# Altium schematic sheet P1.schdoc
size 297 x 209 mm; Symbol: Drawing-Symbol_A4; @Project Name: Traffic_Light_Controller_PCB; @Page Count: 1; @Update Date: 2026-06-30; @Create Date: 2026-06-30; @Schematic Name: Schematic1; @Page No: 1; @Page Name: P1; Company: EasyEDA.com; Version: V1.0; Page Size: A4; Device: Drawing-Symbol_A4; @Create Time: 14:19:58; @Update Time: 14:19:58; Border: 1; Width: 1170; Height: 825; Region Start: 1; X Region Count: 6; Y Region Count: 4; Blade Width: 10; Title Block Position: 3; @Board Name: Board1; SheetNumber: 1; SheetTotal: 1
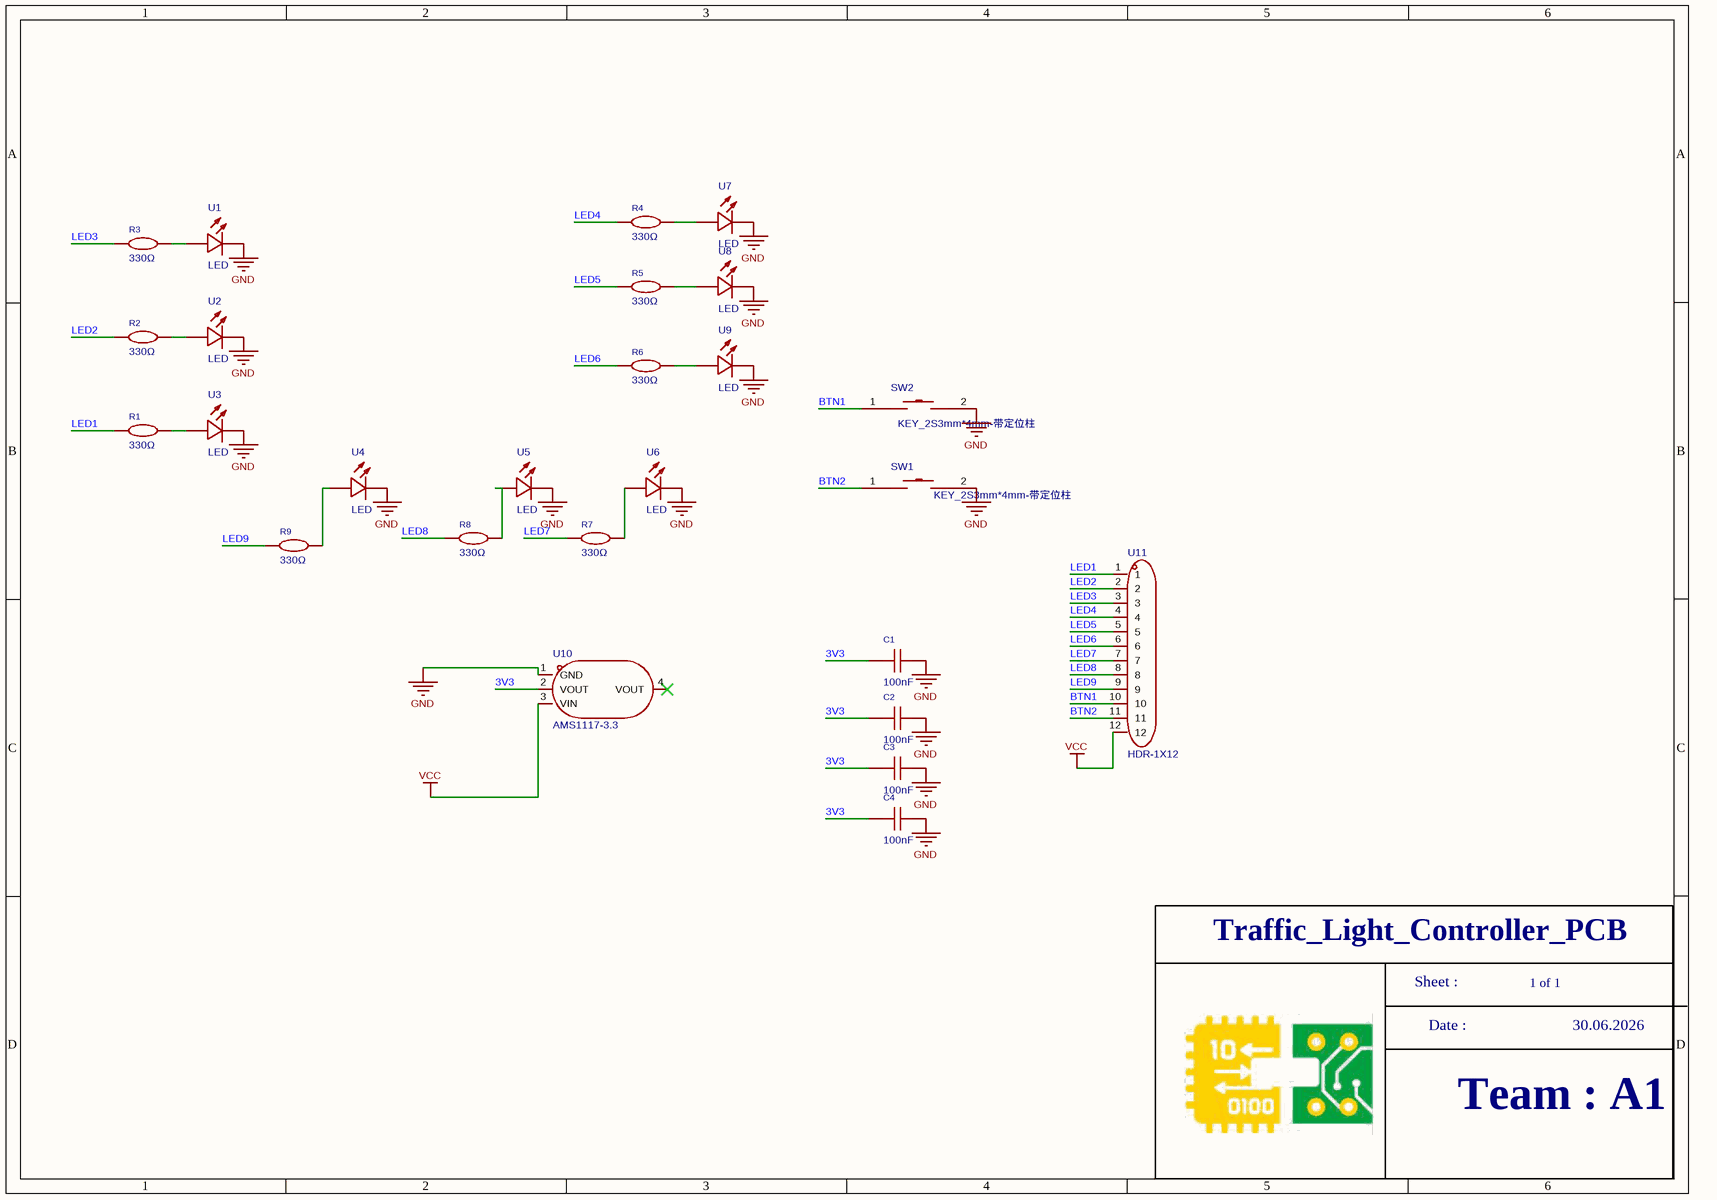
[diagram p0: P1.schdoc]

## Parts
C1  100nF  [CAP-TH_L9.0-W5.0-P7.50-D0.6-1]
C2  100nF  [CAP-TH_L9.0-W5.0-P7.50-D0.6-1]
C3  100nF  [CAP-TH_L9.0-W5.0-P7.50-D0.6-1]
C4  100nF  [CAP-TH_L9.0-W5.0-P7.50-D0.6-1]
R1  330Ω  [R0402]
R2  330Ω  [R0402]
R3  330Ω  [R0402]
R4  330Ω  [R0402]
R5  330Ω  [R0402]
R6  330Ω  [R0402]
R7  330Ω  [R0402]
R8  330Ω  [R0402]
R9  330Ω  [R0402]
SW1  KEY_2S3mm*4mm-带定位柱  [KEY-SMD_L4.0-W3.7-LS4.8]
SW2  KEY_2S3mm*4mm-带定位柱  [KEY-SMD_L4.0-W3.7-LS4.8]
U1  LED  [LED-TH_BD4.0-P2.54-FD_RED]
U2  LED  [LED-TH_BD4.0-P2.54-FD_RED]
U3  LED  [LED-TH_BD4.0-P2.54-FD_RED]
U4  LED  [LED-TH_BD4.0-P2.54-FD_RED]
U5  LED  [LED-TH_BD4.0-P2.54-FD_RED]
U6  LED  [LED-TH_BD4.0-P2.54-FD_RED]
U7  LED  [LED-TH_BD4.0-P2.54-FD_RED]
U8  LED  [LED-TH_BD4.0-P2.54-FD_RED]
U9  LED  [LED-TH_BD4.0-P2.54-FD_RED]
U10  AMS1117-3.3  [SOT-223-3_L6.5-W3.4-P2.30-LS7.0-BR]
U11  HDR-1X12  [CONN-TH_HDR-1X12]

## Nets
GND: C1.2 C2.2 C3.2 C4.2 SW1.2 SW2.2 U1.2(-) U2.2(-) U3.2(-) U4.2(-) U5.2(-) U6.2(-) U7.2(-) U8.2(-) U9.2(-) U10.1(GND)
VCC: U10.3(VIN) U11.12
3V3: C1.1 C2.1 C3.1 C4.1 U10.2(VOUT)
BTN1: SW2.1 U11.10
BTN2: SW1.1 U11.11
LED1: R1.1 U11.1
LED2: R2.1 U11.2
LED3: R3.1 U11.3
LED4: R4.1 U11.4
LED5: R5.1 U11.5
LED6: R6.1 U11.6
LED7: R7.1 U11.7
LED8: R8.1 U11.8
LED9: R9.1 U11.9
NetR1_2: R1.2 U3.1(+)
NetR2_2: R2.2 U2.1(+)
NetR3_2: R3.2 U1.1(+)
NetR4_2: R4.2 U7.1(+)
NetR5_2: R5.2 U8.1(+)
NetR6_2: R6.2 U9.1(+)
NetR7_2: R7.2 U6.1(+)
NetR8_2: R8.2 U5.1(+)
NetR9_2: R9.2 U4.1(+)

Not connected (* = marked no-connect by the designer): U10 4(VOUT)*

## Notes on the sheet
- Traffic_Light_Controller_PCB
- Sheet :
- 1 of 1
- Date :
- 30.06.2026
- Team : A1
- Create at
- 2026-06-30
- Schematic
- Board
- Schematic1
- Board1
- Update at
- Page
- P1
- Drawn
- Reviewed
- Version
- V1.0
- Size
- A4
- Page  1  Total  1
- EasyEDA.com

## Library data of the parts
C1-C4 = CFC2G104JD1IJ5085100: Capacitance:100nF Tolerance:±5% Tolerance:±5% Voltage Rating:400V Operating Temperature:-40℃~+105℃ Operating Temperature:-40℃~+105℃; Manufacturer: Dersonic(德尔创); AddInBom: yes; ModelId: 124bf184938f4a40b97b2ab8629c747fÂŽ0819f05c4eef4c71ace90d822a990e87; ModelTransform: 354.33,196.85,0,0,0,0,0,0,-177.165; Tolerance: ±5%; Voltage Rating: 400V; Symbol: CFC2G104JD1IJ5085100; Device: CFC2G104JD1IJ5085100; Supplier: LCSC; Supplier Part: C719327; Manufacturer Part: CFC2G104JD1IJ5085100; Value: 100nF; JLCPCB Part Class: Extended Part; LCSC Part Name: 100nF ±5% 400V; Supplier Footprint: 插件,P=7.5mm; Datasheet: https://item.szlcsc.com/datasheet/CFC2G104JD1IJ5085100/762824.html; ConvertToPcb: yes; FootprintName: CAP-TH_L9.0-W5.0-P7.50-D0.6-1; ModelName: CAP-TH_L9.0-W5.0-P7.50-D0.6-1; Operating Temperature: -40℃~+105℃
R1-R9 = 0402WGF3300TCE: Type:Thick Film Resistors Resistance:330Ω Tolerance:±1% Tolerance:±1% Power(Watts):1/16W Voltage-Supply(Max):50V Temperature Coefficient:±100ppm/℃ Temperature Coefficient:±100ppm/℃ Operating Temperature:-55℃~+155℃ Operating Temperature:-55℃~+155℃; Manufacturer: UNI-ROYAL(厚声); AddInBom: yes; ModelId: efdecb7dae4442949d28eecaf748420fÂŽ0819f05c4eef4c71ace90d822a990e87; ModelName: R0402_L1.0-W0.5-H0.4; ModelTransform: 39.37,19.685,0,0,0,0,0,0,0; Tolerance: ±1%; Power(Watts): 1/16W; Voltage-Supply(Max): 50V; Symbol: 0402WGF3300TCE; Device: 0402WGF3300TCE; Supplier: LCSC; Manufacturer Part: 0402WGF3300TCE; Supplier Part: C25104; Value: 330Ω; JLCPCB Part Class: Basic Part; LCSC Part Name: 330Ω ±1% 62.5mW 厚膜电阻; Supplier Footprint: 0402; Datasheet: https://item.szlcsc.com/datasheet/0402WGF3300TCE/25847.html; ConvertToPcb: yes; FootprintName: R0402; Type: Thick Film Resistors; Temperature Coefficient: ±100ppm/℃; Operating Temperature: -55℃~+155℃
SW1 SW2 = KEY_2S3mm*4mm-带定位柱: AddInBom: yes; ModelId: 1eea03cc2c01498eb851c8e8bc2c68faÂŽ0819f05c4eef4c71ace90d822a990e87; ModelTransform: 226.3775,145.669,0,0,0,0,0,-15.118,-19.685; Symbol: KEY_2S3MM*4MM-带定位柱; Device: KEY_2S3mm*4mm-带定位柱; LCSC Part Name: KEY_2S3mm*4mm-带定位柱; SupplierPart: C9900019844; ManufacturerPart: KEY_2S3mm*4mm-带定位柱; Supplier Footprint: 二脚小乌龟SW_PUSH-带定位柱; JLCPCB Part Class: Extended Part; Supplier: LCSC; ConvertToPcb: yes; FootprintName: KEY-SMD_L4.0-W3.7-LS4.8; ModelName: KEY-SMD_L4.0-W3.7-LS4.8
U1-U9 = LED: Symbol: LED_C9900015665; AddInBom: yes; ModelId: ebc6af6b0c6f45ef98776efe17486e55ÂŽ0819f05c4eef4c71ace90d822a990e87; ModelTransform: 137.561,157.46465,0,0,0,0,-8.858,0,-196.85; Device: LED; LCSC Part Name: LED; SupplierPart: C9900015665; ManufacturerPart: LED; Supplier Footprint: SIP-2P; JLCPCB Part Class: Extended Part; Supplier: LCSC; ConvertToPcb: yes; FootprintName: LED-TH_BD4.0-P2.54-FD_RED; ModelName: LED-TH_BD4.0-P2.54-FD_RED
U10 = AMS1117-3.3_C6186: Output Configuration:Positive Voltage - Supply:15V Output Voltage:3.3V Output Voltage:3.3V Output Current:1A Power Supply Rejection Ratio (PSRR):72dB@(120Hz) Voltage Dropout:1.1V@(800mA) standby current:5mA Noise:0.003%Vout Features:Short Circuit Protecti; Manufacturer: Advanced Monolithic Systems; AddInBom: yes; ModelId: e5f8b32b785646b6abbef6d5ae2fe060ÂŽ0819f05c4eef4c71ace90d822a990e87; ModelName: SOT-223-4P_L6.5-W3.5-H1.6-LS7.0-P2.30; ModelTransform: 279.89794,255.905,0,180,0,0,-3.9385,-0.0005,0; Voltage - Supply: 15V; Output Voltage: 3.3V; Output Current: 1A; standby current: 5mA; Output Type: Fixed; Number of Outputs: 1; Symbol: AMS1117-3.3; Device: AMS1117-3.3_C6186; LCSC Part Name: 3.3V 1A 15V; SupplierPart: C6186; ManufacturerPart: AMS1117-3.3; Supplier Footprint: SOT-223; JLCPCB Part Class: Basic Part; Datasheet: https://item.szlcsc.com/datasheet/AMS1117-3.3/6652.html; Supplier: LCSC; ConvertToPcb: yes; FootprintName: SOT-223-3_L6.5-W3.4-P2.30-LS7.0-BR; Output Configuration: Positive; Power Supply Rejection Ratio (PSRR): 72dB@(120Hz); Voltage Dropout: 1.1V@(800mA); Noise: 0.003%Vout; Features: Short Circuit Protection；Thermal shutdown；Over Current Protection; Operating Temperature: -40℃~+125℃
U11 = HDR-1X12: AddInBom: yes; ModelId: 68e2978f1141402ba98932049f5e17c1ÂŽ0819f05c4eef4c71ace90d822a990e87; ModelTransform: 1023.62,200.787,0,0,0,0,0,-17.717,-133.858; Symbol: HDR-1X12; Device: HDR-1X12; LCSC Part Name: HDR-1X12; SupplierPart: C9900004879; ManufacturerPart: HDR-1X12; Supplier Footprint: 插件; JLCPCB Part Class: Extended Part; Supplier: LCSC; ConvertToPcb: yes; FootprintName: CONN-TH_HDR-1X12; ModelName: CONN-TH_HDR-1X12